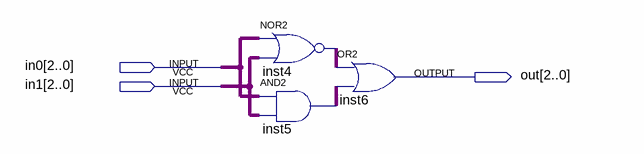
[diagram p0: schematic sheet]
// Quartus schematic XNOR3bit.bdf as structural Verilog: 3 symbols, 3 pins
module XNOR3bit (
  input  [2:0] in0,
  input  [2:0] in1,
  output [2:0] out
);

  wire [2:0] inst4_out, inst5_out;

  assign inst4_out = ~(in0 | in1);  // NOR2 inst4, 3 bits wide
  assign inst5_out = in0 & in1;  // AND2 inst5, 3 bits wide
  assign out = inst4_out | inst5_out;  // OR2 inst6, 3 bits wide
endmodule
